# Altium schematic sheet 2021-06-30.schdoc
size 309 x 201 mm
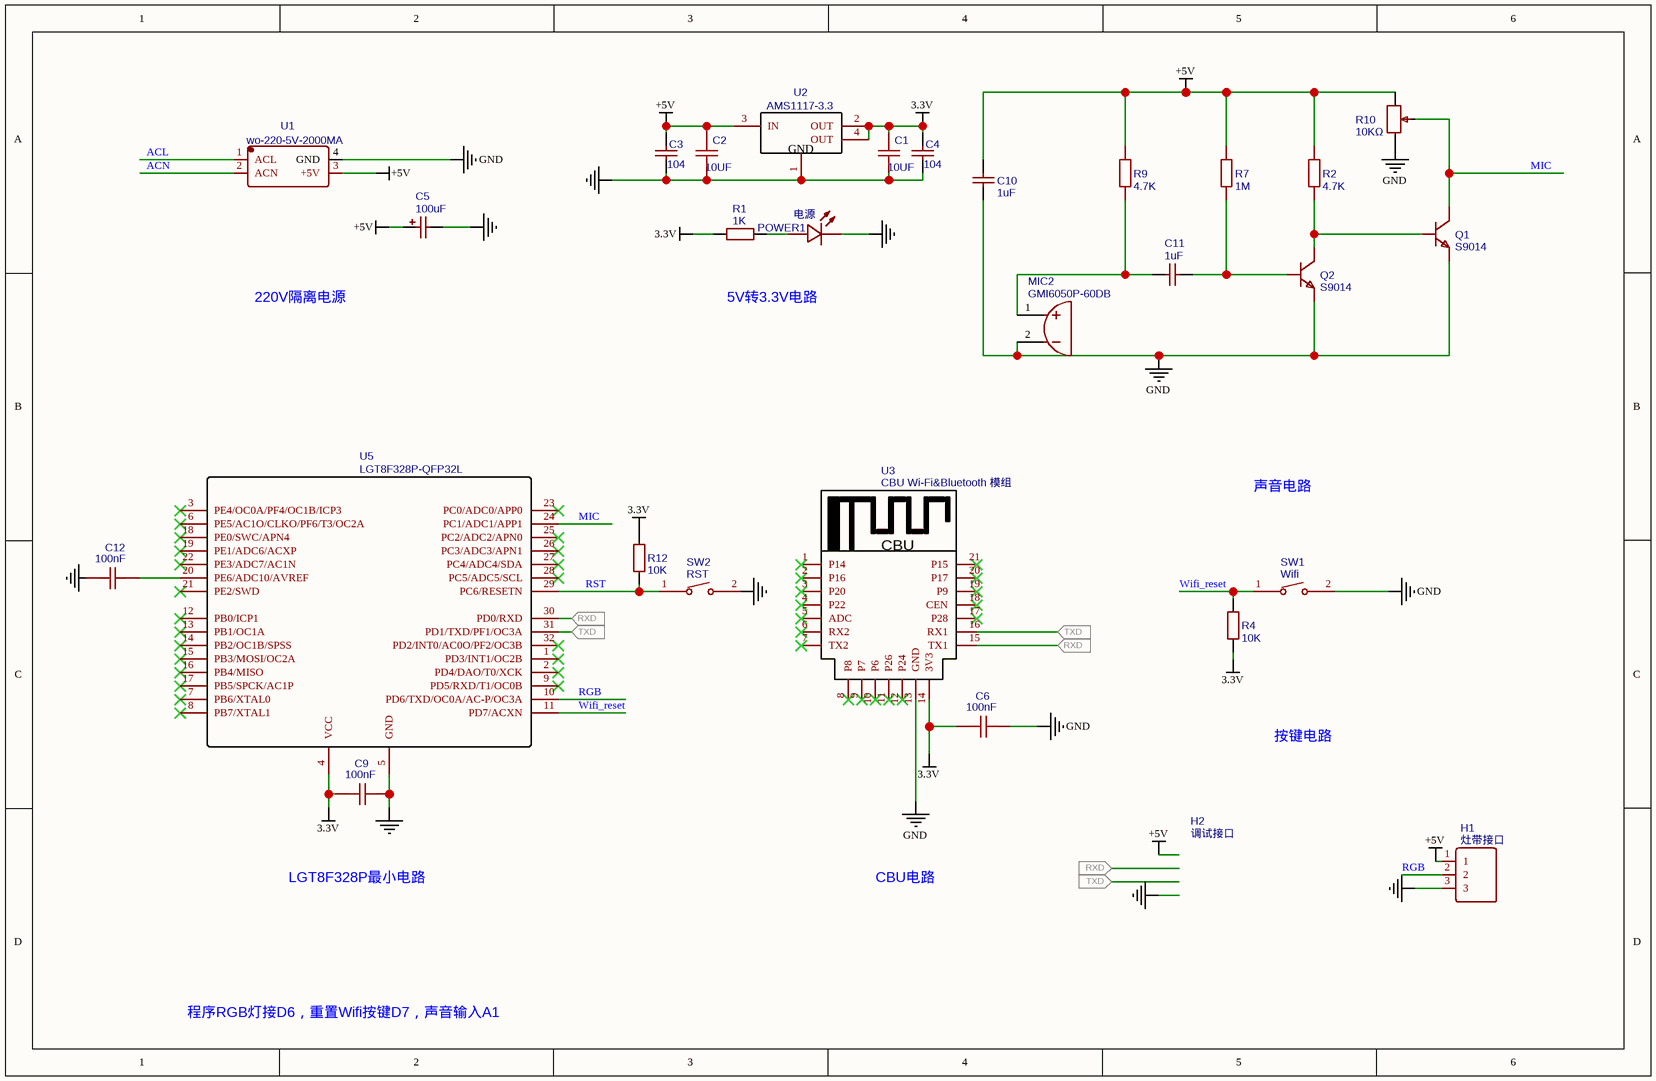
[diagram p0: 2021-06-30.schdoc]

## Parts
C1  10UF  [C0603]
C2  10UF  [C0603]
C3  104  [C0603]
C4  104  [C0603]
C5  100uF  [CAP-SMD_L3.5-W2.8]
C6  100nF  [C0603]
C9  100nF  [C0603]
C10  1uF  [C0603]
C11  1uF  [C0603]
C12  100nF  [C0603]
H1  灶带接口  [2.54_3P]
H2  调试接口  [4_2.54]
MIC2  GMI6050P-60DB  [MIC-TH_BD6.0-P1.90-D0.4-L-RD]
POWER1  电源  [LED0603-R-RD]
Q1  S9014  [SOT-23-3_L2.9-W1.6-P1.90-LS2.8-BR]
Q2  S9014  [SOT-23-3_L2.9-W1.6-P1.90-LS2.8-BR]
R1  1K  [R0603]
R2  4.7K  [R0603]
R4  10K  [R0603]
R7  1M  [R0603]
R9  4.7K  [R0603]
R10  10KΩ  [10K贴片可调电阻]
R12  10K  [R0603]
SW1  Wifi  [KEY-TACT-SMD-6.0*3.5]
SW2  RST  [KEY-TACT-SMD-6.0*3.5]
U1  wo-220-5V-2000MA  [WO-220-5V-2000MA]
U2  AMS1117-3.3  [SOT-223-3_L6.5-W3.4-P2.30-LS7.0-BR]
U3  CBU Wi-Fi&Bluetooth 模组  [CBU WIFI&BLUETOOTH]
U5  LGT8F328P-QFP32L  [LGT8F328P-QFP32L]

## Ports
RXD (in), TXD (in)

## Nets
3.3V: C1.2 C4.1 C6.2 C9.2 R1.1 R4.1 R12.2 U2.2(OUT) U2.4(OUT) U3.14(3V3) U5.4(VCC)
+5V: C2.2 C3.1 C5.1 C10.2 H1.1 R2.1 R7.2 R9.1 R10.3 U1.3(+5V) U2.3(IN)
GND: C1.1 C2.1 C3.2 C4.2 C5.2 C6.1 C9.1 C10.1 C12.2 H1.3 MIC2.2 POWER1.2(K) Q1.2(E) Q2.2(E) R10.1 SW1.2 SW2.2 U1.4(GND) U2.1(GND) U3.13(GND) U5.5(GND)
ACL: U1.1(ACL)
ACN: U1.2(ACN)
MIC: Q1.3(C) R10.2 U5.24(PC1/ADC1/APP1)
RGB: H1.2 U5.10(PD6/TXD/OC0A/AC-P/OC3A)
RST: R12.1 SW2.1 U5.29(PC6/RESETN)
RXD: U3.15(TX1) U5.30(PD0/RXD) ; port RXD
TXD: U3.16(RX1) U5.31(PD1/TXD/PF1/OC3A) ; port TXD
Wifi_reset: R4.2 SW1.1 U5.11(PD7/ACXN)
NetC11_1: C11.1 MIC2.1 R9.2
NetC11_2: C11.2 Q2.1(B) R7.1
NetC12_1: C12.1 U5.20(PE6/ADC10/AVREF)
NetPOWER1_1: POWER1.1(A) R1.2
NetQ1_1: Q1.1(B) Q2.3(C) R2.2

Not connected (* = marked no-connect by the designer): U3 1(P14)* 2(P16)* 3(P20)* 4(P22)* 5(ADC)* 6(RX2)* 7(TX2)* 8(P8)* 9(P7)* 10(P6)* 11(P26)* 12(P24)* 17(P28)* 18(CEN)* 19(P9)* 20(P17)* 21(P15)*; U5 1(PD3/INT1/OC2B)* 2(PD4/DAO/T0/XCK)* 3(PE4/OC0A/PF4/OC1B/ICP3)* 6(PE5/AC1O/CLKO/PF6/T3/OC2A)* 7(PB6/XTAL0)* 8(PB7/XTAL1)* 9(PD5/RXD/T1/OC0B)* 12(PB0/ICP1)* 13(PB1/OC1A)* 14(PB2/OC1B/SPSS)* 15(PB3/MOSI/OC2A)* 16(PB4/MISO)* 17(PB5/SPCK/AC1P)* 18(PE0/SWC/APN4)* 19(PE1/ADC6/ACXP)* 21(PE2/SWD)* 22(PE3/ADC7/AC1N)* 23(PC0/ADC0/APP0)* 25(PC2/ADC2/APN0)* 26(PC3/ADC3/APN1)* 27(PC4/ADC4/SDA)* 28(PC5/ADC5/SCL)* 32(PD2/INT0/AC0O/PF2/OC3B)*

## Notes on the sheet
- 220V隔离电源
- 5V转3.3V电路
- 声音电路
- 按键电路
- LGT8F328P最小电路
- CBU电路
- 程序RGB灯接D6，重置Wifi按键D7，声音输入A1
- (in symbol CBU Wi-Fi&Bluetooth 模组) CBU

## Library data of the parts
C1 C2 = 10UF: BOM_Manufacturer: Samsung Electro-Mechanics; nameAlias: Value; Contributor: LCSC; BOM_Supplier: LCSC; BOM_Supplier Part: C15415; BOM_Manufacturer Part: 10uF; JLCPCB Part Class: Extended Part; spicePre: C; spiceSymbolName: 10UF
C3 C4 = 104: BOM_Manufacturer: FH; BOM_Manufacturer Part: 0603B104K500NT; nameAlias: Capacitance; BOM_Supplier: LCSC; BOM_Supplier Part: C30926; spicePre: C; spiceSymbolName: 0603B104K500NT
C5 = 100uF: BOM_Manufacturer: AVX; BOM_Manufacturer Part: TAJB107K006RNJ; nameAlias: Capacitance; SMT Type: Basic; BOM_Supplier: LCSC; BOM_LCSC Assembly: Yes; BOM_Supplier Part: C16133; spicePre: C; spiceSymbolName: TAJB107K006RNJ
C6 C9 C12 = 100nF: BOM_Manufacturer: YAGEO; BOM_Manufacturer Part: CC0603KRX7R9BB104; nameAlias: Capacitance; SMT Type: Basic; BOM_Supplier: LCSC; BOM_LCSC Assembly: Yes; BOM_Supplier Part: C14663; spicePre: C; spiceSymbolName: CC0603KRX7R9BB104
C10 C11 = 1uF: BOM_Manufacturer Part: CC0603KRX5R8BB105; BOM_Manufacturer: YAGEO; nameAlias: Capacitance; BOM_Supplier: LCSC; BOM_Supplier Part: C14664; BOM_JLCPCB Part Class: Extended Part; spicePre: C; spiceSymbolName: CC0603KRX5R8BB105
H1 = 灶带接口: BOM_Manufacturer: BOOMELE; BOM_Manufacturer Part: 2.54mm 1*3p; Contributor: 520world; BOM_Supplier: LCSC; image: //image.lceda.cn/szlcsc/C50950.jpg; BOM_Supplier Part: C50950; spicePre: H; spiceSymbolName: 2.54_1x3
H2 = 调试接口: BOM_Manufacturer: BOOMELE; BOM_Manufacturer Part: 2.54mm 1*4p; Contributor: 520world; image: //image.lceda.cn/szlcsc/C50950.jpg; BOM_Supplier Part: C50950; spicePre: H; spiceSymbolName: 2.54_1x4
MIC2 = GMI6050P-60DB: BOM_Manufacturer: INGHAi; Contributor: LCSC; BOM_Supplier: LCSC; BOM_Supplier Part: C233951; BOM_Manufacturer Part: GMI6050P-60db; BOM_JLCPCB Part Class: Extended Part; spicePre: M; spiceSymbolName: GMI6050P-60DB
POWER1 = 电源: BOM_Manufacturer: Orient; BOM_Manufacturer Part: ORH-R36A(0.6T); Contributor: LCSC; SMT Type: Extend; BOM_Supplier: LCSC; BOM_Supplier Part: C205445; BOM_LCSC Assembly: Yes; spicePre: L; spiceSymbolName: ORH-R36A(0.6T)
Q1 Q2 = S9014: BOM_Manufacturer: Hottech; Contributor: LCSC; BOM_Supplier: LCSC; BOM_Manufacturer Part: S9014; BOM_Supplier Part: C181164; BOM_JLCPCB Part Class: Extended Part; spicePre: Q; spiceSymbolName: S9014
R1 = 1K: BOM_Manufacturer: UniOhm; BOM_Manufacturer Part: 0603WAF1001T5E; nameAlias: Resistance (Ohms); BOM_Supplier: LCSC; BOM_Supplier Part: C21190; BOM_JLCPCB Part Class: Basic Part; spicePre: R; spiceSymbolName: 0603WAF1001T5E
R2 R9 = 4.7K: BOM_Manufacturer: Tyohm; BOM_Manufacturer Part: RMC06034.7k5%N; nameAlias: Resistance (Ohms); Contributor: LCSC; BOM_Supplier: LCSC; BOM_Supplier Part: C269694; BOM_JLCPCB Part Class: Extended Part; spicePre: R; spiceSymbolName: RMC06034.7K5%N
R4 = 10K: BOM_Manufacturer: UniOhm; BOM_Manufacturer Part: 0603WAF510KT5E; nameAlias: Resistance (Ohms); BOM_Supplier: LCSC; BOM_Supplier Part: C25197; BOM_JLCPCB Part Class: Basic Part; spicePre: R; spiceSymbolName: 0603WAF510KT5E
R7 = 1M: BOM_Manufacturer: Huaxin S&T; BOM_Manufacturer Part: MR06X105JTL; nameAlias: Resistance (Ohms); Contributor: LCSC; BOM_Supplier: LCSC; BOM_Supplier Part: C327832; spicePre: R; spiceSymbolName: MR06X105JTL
R10 = 10KΩ: BOM_Manufacturer: PANASONIC; BOM_Manufacturer Part: EVM3ESX50BY3; nameAlias: Value; BOM_Supplier: LCSC; BOM_Supplier Part: C11964; spicePre: R; spiceSymbolName: EVM3ESX50BY3
R12 = 10K: BOM_Manufacturer: UniOhm; BOM_Manufacturer Part: 0603WAF1002T5E; nameAlias: Resistance (Ohms); SMT Type: Basic; BOM_Supplier: LCSC; BOM_LCSC Assembly: Yes; BOM_Supplier Part: C25804; spicePre: R; spiceSymbolName: 0603WAF1002T5E
SW1 = Wifi: BOM_Manufacturer: HYP; BOM_Manufacturer Part: 1TS002B-1700-5000; Contributor: LCSC; BOM_Supplier: LCSC; BOM_Supplier Part: C318838; spicePre: S
SW2 = RST: BOM_Manufacturer: HYP; BOM_Manufacturer Part: 1TS002B-1700-5000; Contributor: LCSC; BOM_Supplier: LCSC; BOM_Supplier Part: C318838; spicePre: S
U1 = wo-220-5V-2000MA: Contributor: 520world; spicePre: U; spiceSymbolName: wo-220-5V-2000MA
U2 = AMS1117-3.3: BOM_Manufacturer: AMS; sourceId: dwIGgezVh; SMT Type: Basic; Contributor: LCEDA_01; timeStamp: 1476261164; BOM_Supplier: LCSC; BOM_Manufacturer Part: AMS1117-3.3; BOM_LCSC Assembly: Yes; image: //image.lceda.cn/szlcsc/C6186.jpg; BOM_Supplier Part: C6186; spicePre: U; spiceSymbolName: AMS1117-3.3_LCEDA
U3 = CBU Wi-Fi&Bluetooth 模组: Contributor: chenlf; BOM_Supplier: Tuya; spicePre: U; spiceSymbolName: CBU Wi-Fi&amp;Bluetooth 模组
U5 = LGT8F328P-QFP32L: BOM_Manufacturer: LGT; SMT Type: Extend; Contributor: lulitianyu; BOM_Supplier: LCSC; BOM_Supplier Part: C14877; spicePre: U; spiceSymbolName: LGT8F328P-QFP32L